# EAGLE design base-2u-psu (EAGLE 4.16)
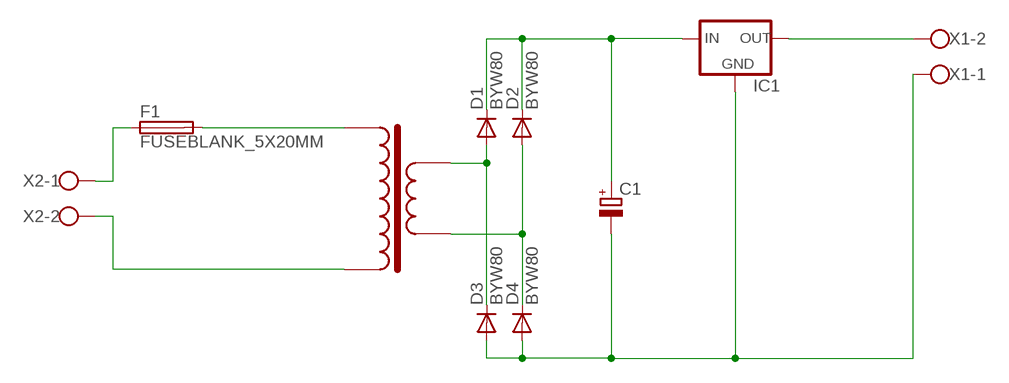
[diagram p0: schematic, sheet 1]

## Parts
C1  CPOL-EUE7.5-18  [E7,5-18]
D1  BYW80  [TO220ACS]
D2  BYW80  [TO220ACS]
D3  BYW80  [TO220ACS]
D4  BYW80  [TO220ACS]
F1  FUSEBLANK_5X20MM  [FUSE_HOLDER_5X20MM]
IC1  78XXS  [78XXS]
U$1  POWER_SUPPLY_TRANFORMER  [PCB_TRANSFORMER]
X1  W237-102  [W237-102]
X2  W237-102  [W237-102]

## Nets
N$1: D1.A D3.C U$1.P$1
N$2: D2.A D4.C U$1.P$2
N$3: F1.1 X2.1
N$4: F1.2 U$1.P$3
N$5: U$1.P$4 X2.2
N$6: C1.+ D1.C D2.C IC1.IN
N$7: C1.- D3.A D4.A IC1.GND X1.1
N$8: IC1.OUT X1.2

## Library data of the parts
C1 = rcl:CPOL-EU: POLARIZED CAPACITOR, European symbol
D1-D4 = diode:BYW80: DIODE high-efficiency fast recovery rectifier (ST)
F1 = fuse:FUSE: Fuse
IC1 = cls:78XXS: VOLTAGE REGULATOR
U$1 = my:POWER_SUPPLY_TRANFORMER
X1 X2 = con-wago-500:W237-102: WAGO SCREW CLAMP

## Board
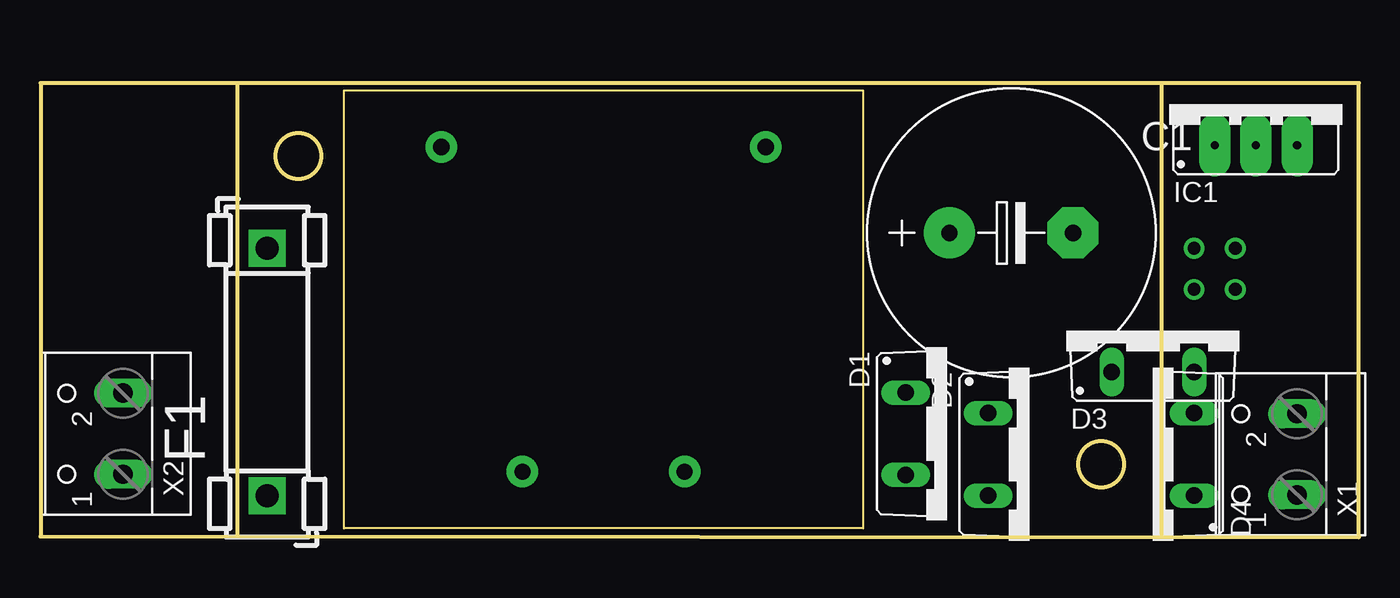
[diagram p1: board, top side]
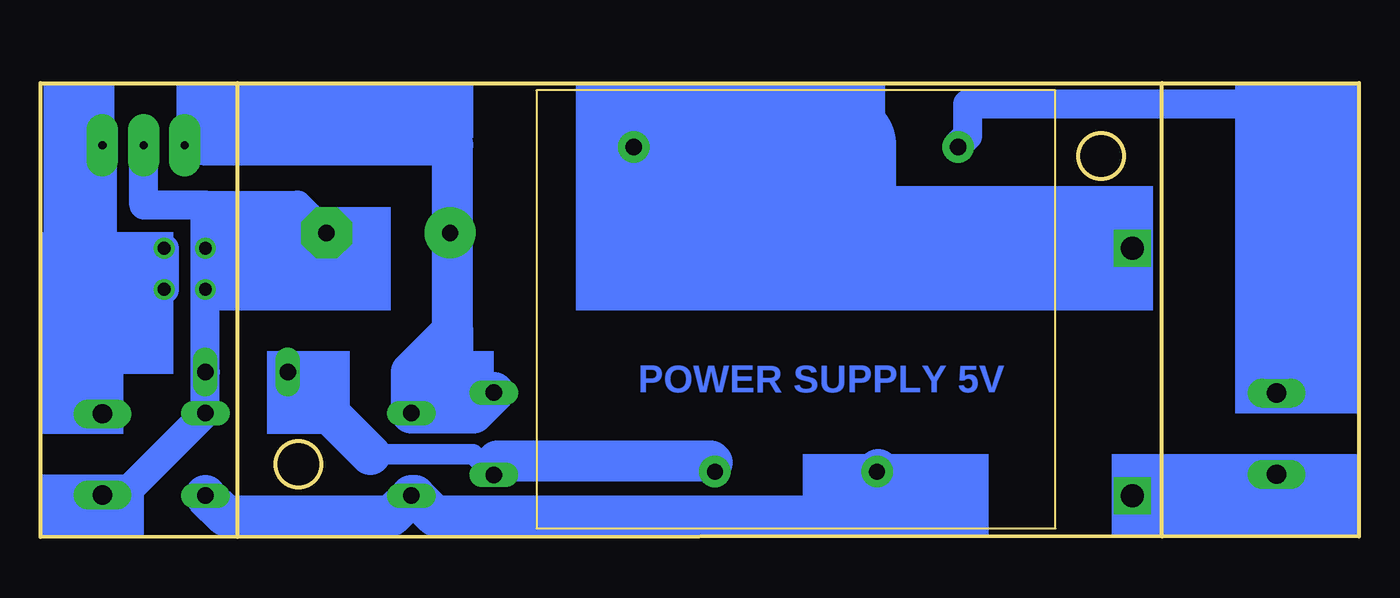
[diagram p2: board, bottom side, seen from below]

Size 81.28 x 27.98 mm. Coordinates in mm from the lower left corner, seen from the top.
Outline: 12.14,27.98 81.28,27.98 81.28,0 0,0.04 0,27.98 12.14,27.98
Outline: 12.14,0.03 12.14,27.98
Outline: 69.14,0.01 69.14,27.98
Outline: circle at 15.89,23.49 radius 1.4
Outline: circle at 65.39,4.49 radius 1.4
Copper layers (1*16): Top 0.035mm / dielectric 1.5mm / Bottom 0.035mm
Design rules "default": minimum track width 10mil, minimum drill 24mil, track to track 8mil, track to pad 8mil, pad to pad 8mil, via to via 8mil, smd to smd 8mil, copper to edge 40mil, drill to drill 8mil, minimum pad ring 10mil, minimum via ring 8mil, stop-mask expansion 4mil, vias tented up to drill 0mil, thermal gap 10mil

### Footprints (pad centres in the part's own frame; a part is rotated, then mirrored left to right if it is on the bottom)
E7,5-18 = drill 1.016 pad 3.15 round: + -3.81,0 | drill 1.016 pad 3.15 octagon: - 3.81,0
TO220ACS = drill 1.016 long: A 2.54,-2.54; C -2.54,-2.54
FUSE_HOLDER_5X20MM = drill 1.422 pad 2.286 square: 1 0,0; 2 15.24,0
78XXS = drill 0.5 pad 1.93 long: GND 0,-2.54; IN -2.54,-2.54; OUT 2.54,-2.54
PCB_TRANSFORMER = drill 1 pad 1.93 round: P$1 -10,-5; P$2 -10,5; P$3 10,-10; P$4 10,10
W237-102 = drill 1.194 long: 1 -2.5,-1.27; 2 2.5,-1.27

### Placement (x,y rotation side)
C1  59.84,18.75 0 top
D1  55.88,6.37 270 top
D2  60.96,5.1 270 top
D3  68.58,12.72 0 top
D4  68.58,5.1 90 top
F1  13.97,2.56 90 top
IC1  74.93,26.69 0 top
U$1  34.71,14.04 90 top
X1  76.2,5.1 90 top
X2  3.81,6.37 90 top

### Tracks (layer width: path | path; a pad name or v marks a point on that pad's centre or on a via)
N$1
  Bottom 0.254: D1.A 53.34,4.46 53.12,4.68 | 39.71,3.95 39.67,3.91 | U$1.P$1 39.71,3.95 | 39.86,4.58 39.86,4.09 39.71,3.95
  Bottom 1.27: D1.A 54.61,5.1 60.96,5.1
  Bottom 2.54: 53.12,4.68 39.96,4.68 39.86,4.58 | 60.96,5.1 D3.C
N$2
  Bottom 2.54: U$1.P$2 29.71,4.08 29.64,4.15 29.32,3.83 29.21,3.83 31.75,1.29 56.95,1.29 58.22,2.56 D2.A 59.69,1.29 69.85,1.29 D4.C
N$3
  Bottom 2.54: X2.1 5.08,3.83 6.35,2.56 F1.1
N$4
  Bottom 1.778: F1.2 20.32,17.8
  Bottom 6.452: 20.32,17.8 31.75,17.8 31.75,24.15 44.45,24.15 44.56,24.04 U$1.P$3
N$5
  Bottom 1.27: 5.08,24.15 7.62,26.69
  Bottom 1.778: 7.62,26.69 24.13,26.69 24.13,24.73 24.73,24.14 24.71,24.12 U$1.P$4
  Bottom 2.54: X2.2 5.08,24.15
N$6
  Bottom 0.254: 71.12,24.15 IC1.IN
  Bottom 2.54: 55.88,19.07 55.88,18.75 C1.+ 56.03,18.91 55.88,19.07 | 55.88,19.07 55.88,24.15 71.12,24.15 | D1.C 54.61,7.64 D2.C 58.42,10.18 55.88,12.72 55.88,19.07
N$7
  Bottom 1.778: C1.- 63.72,18.75 65.44,20.46 71.12,20.46 | 71.12,20.46 74.92,20.46 74.92,24.11 74.93,24.12 IC1.GND | X1.1 76.16,2.6 D4.A D3.A 71.12,20.46
N$8
  Bottom 1.778: IC1.OUT 77.47,17.8 73.66,17.8 73.66,15.26 77.47,15.26 X1.2
N$13  (via drill 0.8 pad 1.27)
  other vias: 71.12,15.26
N$14  (via drill 0.8 pad 1.27)
  other vias: 71.12,17.8
N$21  (via drill 0.8 pad 1.27)
  other vias: 73.66,17.8
N$22  (via drill 0.8 pad 1.27)
  other vias: 73.66,15.26
(copper drawn outside any net)
  shapes: Bottom area x14

### Text on the board
Bottom: POWER SUPPLY 5V
Measures: 24.74 | 15.24 | 5.74 | 15.89 | 40.64 | 65.39